# Altium schematic sheet 1. BD.SchDoc
size A4; SheetNumber: 1; SheetTotal: 6
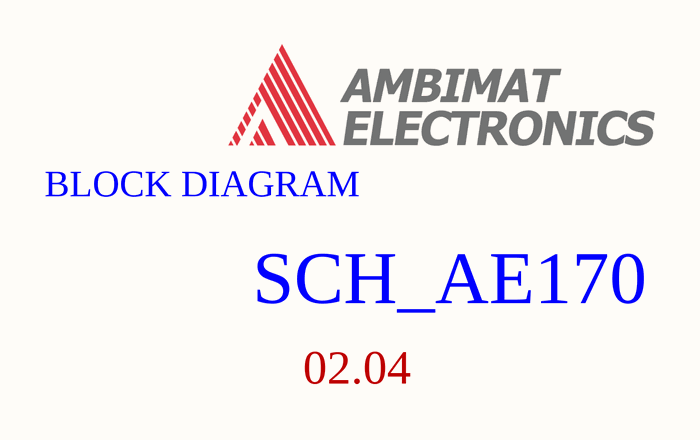
[diagram p0: 1. BD.SchDoc]

## Notes on the sheet
- BLOCK DIAGRAM
- SCH_AE170
- 02.04
- TITLE:
- Design By:
- NOTE: THIS DRAWING AND CONTENTS ARE CONFIDENTIAL AND ARE NOT TO BE COPIED
- Document Number:
- Rev:
- Sheet:
- of